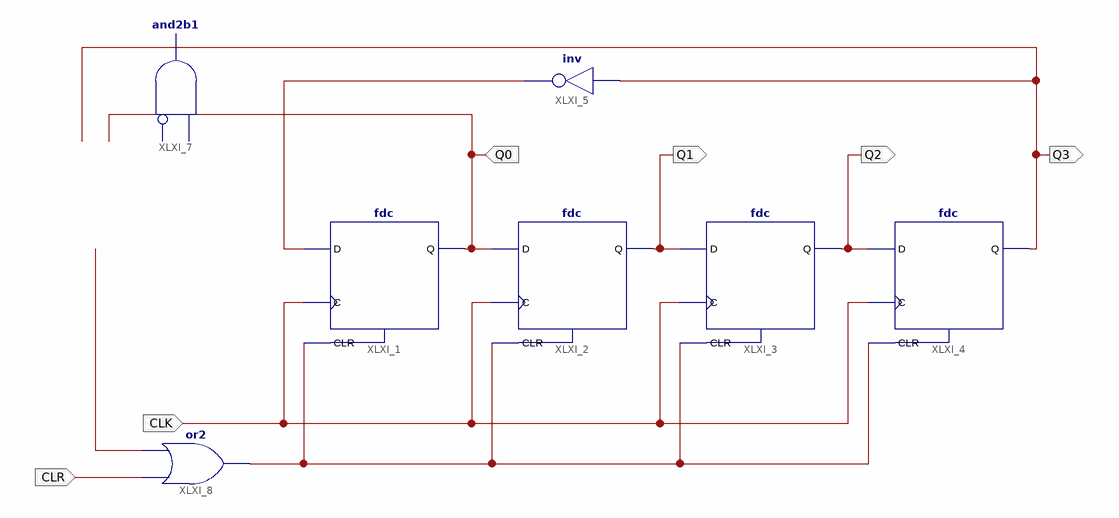
[diagram p0: schematic sheet 1]
// Xilinx ISE schematic p3ej1.sch (spartan3) as structural Verilog: 7 symbols, 6 ports
module p3ej1 (
  input  Q0,
  input  CLK,
  input  CLR,
  output Q1,
  output Q2,
  output Q3
);

  wire XLXN_5, XLXN_20, XLXN_56;

  fdc XLXI_3 (.C(CLK), .CLR(XLXN_5), .D(Q1), .Q(Q2));
  fdc XLXI_2 (.C(CLK), .CLR(XLXN_5), .D(Q0), .Q(Q1));
  fdc XLXI_1 (.C(CLK), .CLR(XLXN_5), .D(XLXN_56), .Q(Q0));
  fdc XLXI_4 (.C(CLK), .CLR(XLXN_5), .D(Q2), .Q(Q3));
  not XLXI_5 (XLXN_56, Q3);
  and XLXI_7 (XLXN_20, ~Q0, Q3);  // and2b1
  or XLXI_8 (XLXN_5, CLR, XLXN_20);
endmodule
